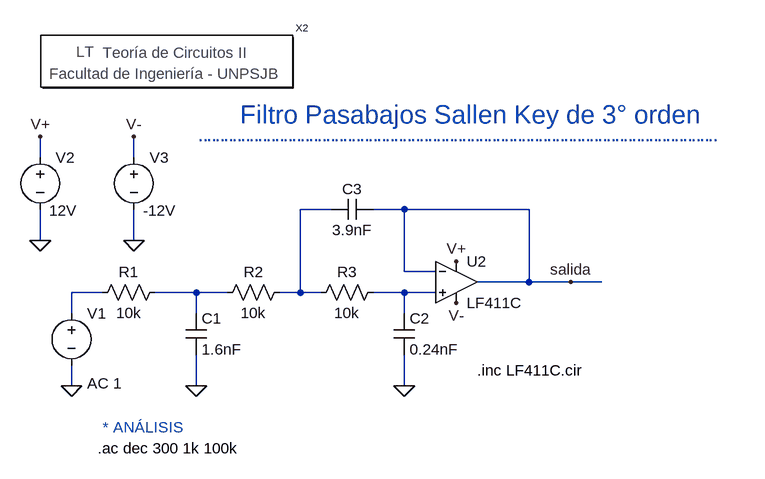
[diagram p0: schematic Filtro pasabajos Sallen Key de 3 orden con LF411.asc]
Filtro pasabajos Sallen Key de 3 orden con LF411.asc, the LTspice schematic file:
Version 4
SHEET 1 1148 680
WIRE -112 -96 -112 -128
WIRE 32 -96 32 -128
WIRE 336 -16 288 -16
WIRE 448 -16 400 -16
WIRE 640 -16 448 -16
WIRE -112 32 -112 -16
WIRE 32 32 32 -16
WIRE 448 80 448 -16
WIRE 496 80 448 80
WIRE 640 96 640 -16
WIRE 640 96 560 96
WIRE 704 96 640 96
WIRE 752 96 704 96
WIRE -16 112 -64 112
WIRE 128 112 64 112
WIRE 176 112 128 112
WIRE 288 112 288 -16
WIRE 288 112 256 112
WIRE 320 112 288 112
WIRE 448 112 400 112
WIRE 496 112 448 112
WIRE -64 144 -64 112
WIRE 128 144 128 112
WIRE 448 144 448 112
WIRE -64 256 -64 224
WIRE 128 256 128 208
WIRE 448 256 448 208
FLAG -64 256 0
FLAG 128 256 0
FLAG 448 256 0
FLAG 704 96 salida
FLAG -112 32 0
FLAG -112 -128 V+
FLAG 32 32 0
FLAG 32 -128 V-
FLAG 528 64 V+
FLAG 528 128 V-
SYMBOL voltage -64 128 R0
WINDOW 123 24 124 Left 2
WINDOW 39 0 0 Left 2
SYMATTR Value2 AC 1
SYMATTR InstName V1
SYMATTR Value ""
SYMBOL res 80 96 R90
WINDOW 0 0 56 VBottom 2
WINDOW 3 32 56 VTop 2
SYMATTR InstName R1
SYMATTR Value 10k
SYMBOL res 272 96 R90
WINDOW 0 0 56 VBottom 2
WINDOW 3 32 56 VTop 2
SYMATTR InstName R2
SYMATTR Value 10k
SYMBOL res 416 96 R90
WINDOW 0 0 56 VBottom 2
WINDOW 3 32 56 VTop 2
SYMATTR InstName R3
SYMATTR Value 10k
SYMBOL cap 112 144 R0
SYMATTR InstName C1
SYMATTR Value 1.6nF
SYMBOL cap 432 144 R0
SYMATTR InstName C2
SYMATTR Value 0.24nF
SYMBOL cap 400 -32 R90
WINDOW 0 0 32 VBottom 2
WINDOW 3 32 32 VTop 2
SYMATTR InstName C3
SYMATTR Value 3.9nF
SYMBOL Circuitos2\\Letreros\\Teoría\ de\ Circuitos\ II 80 -240 R0
SYMATTR InstName X2
SYMBOL voltage -112 -112 R0
WINDOW 123 24 124 Left 2
WINDOW 39 0 0 Left 2
WINDOW 3 14 98 Left 2
SYMATTR Value 12V
SYMATTR InstName V2
SYMBOL voltage 32 -112 R0
WINDOW 123 24 124 Left 2
WINDOW 39 0 0 Left 2
WINDOW 3 14 98 Left 2
SYMATTR Value -12V
SYMATTR InstName V3
SYMBOL Opamps\\opamp2 528 32 R0
SYMATTR InstName U2
SYMATTR Value LF411C
TEXT -24 352 Left 2 !.ac dec 300 1k 100k
TEXT 552 -136 Center 4 ;Filtro Pasabajos Sallen Key de 3° orden\n¨¨¨¨¨¨¨¨¨¨¨¨¨¨¨¨¨¨¨¨¨¨¨¨¨¨¨¨¨¨¨¨¨¨¨¨¨¨¨¨¨¨¨¨¨¨¨¨¨¨¨¨¨¨¨¨¨¨¨¨¨
TEXT -16 320 Left 2 ;* ANÁLISIS
TEXT 560 232 Left 2 !.inc LF411C.cir

The netlist it stands for:
* Filtro pasabajos Sallen Key de 3 orden con LF411.asc
V1 N002 0 AC 1
R1 N003 N002 10k
R2 N001 N003 10k
R3 N004 N001 10k
C1 N003 0 1.6nF
C2 N004 0 0.24nF
C3 salida N001 3.9nF
XX2 Teoría de Circuitos II
V2 V+ 0 12V
V3 V- 0 -12V
XU2 N004 salida V+ V- salida LF411C  ; pins In+ In- V+ V- OUT
.ac dec 300 1k 100k
* Filtro Pasabajos Sallen Key de 3° orden
* ¨¨¨¨¨¨¨¨¨¨¨¨¨¨¨¨¨¨¨¨¨¨¨¨¨¨¨¨¨¨¨¨¨¨¨¨¨¨¨¨¨¨¨¨¨¨¨¨¨¨¨¨¨¨¨¨¨¨¨¨¨
* * ANÁLISIS
.inc LF411C.cir
.backanno
.end